# Altium schematic sheet CPU_51.SchDoc: LiveDesign Evaluation - Countdown
size A4; Organization: Altium Limited; Address1: L3, 12a Rodborough Rd; Address2: Frenchs Forest; Address3: NSW; Address4: Australia 2086; DocumentNumber: 2; SheetNumber: 2; SheetTotal: 11
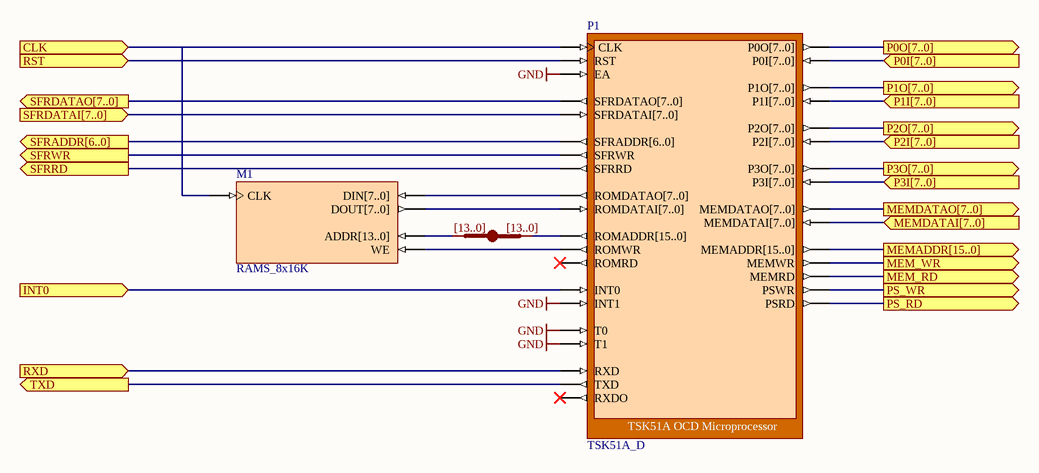
[diagram p0: CPU_51.SchDoc]

## Parts
JB_S1  IndexA: [13..0]  (hidden comment: JB)
M1  RAMS_8x16K
P1  TSK51A_D

## Ports
CLK (in), INT0 (in), MEM_RD (out), MEM_WR (out), MEMADDR[15..0] (out), MEMDATAI[7..0] (in), MEMDATAO[7..0] (out), P0I[7..0] (in), P0O[7..0] (out), P1I[7..0] (in), P1O[7..0] (out), P2I[7..0] (in), P2O[7..0] (out), P3I[7..0] (in), P3O[7..0] (out), PS_RD (out), PS_WR (out), RST (in), RXD (in), SFRADDR[6..0] (out), SFRDATAI[7..0] (in), SFRDATAO[7..0] (out), SFRRD (out), SFRWR (out), TXD (out)

## Nets
GND: P1.EA P1.INT1 P1.T0 P1.T1
CLK: M1.CLK P1.CLK ; port CLK
INT0: P1.INT0 ; port INT0
MEM_RD: P1.MEMRD ; port MEM_RD
MEM_WR: P1.MEMWR ; port MEM_WR
MEMADDR[15..0]: P1.MEMADDR[15..0] ; port MEMADDR[15..0]
MEMDATAI[7..0]: P1.MEMDATAI[7..0] ; port MEMDATAI[7..0]
MEMDATAO[7..0]: P1.MEMDATAO[7..0] ; port MEMDATAO[7..0]
P0I[7..0]: P1.P0I[7..0] ; port P0I[7..0]
P0O[7..0]: P1.P0O[7..0] ; port P0O[7..0]
P1I[7..0]: P1.P1I[7..0] ; port P1I[7..0]
P1O[7..0]: P1.P1O[7..0] ; port P1O[7..0]
P2I[7..0]: P1.P2I[7..0] ; port P2I[7..0]
P2O[7..0]: P1.P2O[7..0] ; port P2O[7..0]
P3I[7..0]: P1.P3I[7..0] ; port P3I[7..0]
P3O[7..0]: P1.P3O[7..0] ; port P3O[7..0]
PS_RD: P1.PSRD ; port PS_RD
PS_WR: P1.PSWR ; port PS_WR
RST: P1.RST ; port RST
RXD: P1.RXD ; port RXD
SFRADDR[6..0]: P1.SFRADDR[6..0] ; port SFRADDR[6..0]
SFRDATAI[7..0]: P1.SFRDATAI[7..0] ; port SFRDATAI[7..0]
SFRDATAO[7..0]: P1.SFRDATAO[7..0] ; port SFRDATAO[7..0]
SFRRD: P1.SFRRD ; port SFRRD
SFRWR: P1.SFRWR ; port SFRWR
TXD: P1.TXD ; port TXD
NetJB_S1_A[0..0]: JB_S1.A[0..0] M1.ADDR[13..0]
NetJB_S1_B[0..0]: JB_S1.B[0..0] P1.ROMADDR[15..0]
NetM1_DIN[7..0]: M1.DIN[7..0] P1.ROMDATAO[7..0]
NetM1_DOUT[7..0]: M1.DOUT[7..0] P1.ROMDATAI[7..0]
NetM1_WE: M1.WE P1.ROMWR

Not connected (* = marked no-connect by the designer): P1 ROMRD* RXDO*

## Notes on the sheet
- Title
- Size:
- Date:
- A4
- Number:
- Time:
- Revision:
- Sheet
- of
- File:

## Library data of the parts
JB_S1 = JB: System BUS Joiner; Published: 29-Jan-2004; Publisher: Altium Limited; Core Revision: 1.00.00; HelpURL: CR0118 FPGA Generic Library Guide.pdf#page=296; Functional Class: Bus Joiner; IndexB: [13..0]
M1 = RAMS_8x16K: Single Port RAM; Memory_Depth: 16384; Memory_Type: RAM_SinglePortBlock; Memory_Width: 8; Memory_ClockEdge: Rising; Nexus_Core: Memory_Program; Memory_EnablePin: False; Published: 23/04/2004; Publisher: Altium Hobart Technology Center
P1 = TSK51A_D: TSK51A OCD Microprocessor; NEXUS_CORE: Processor_OCDS; NEXUS_JTAG_DEVICE: True; NEXUS_JTAG_ORDER: 0; ChildModel1: RAM256x8_TSK51D; ChildCore1: M1; Memory_Configuration: Record[NEXUS_CORE]{}ComponentDesignator[iram]{}Memory_Depth[256]{}Memory_UsageType[ram]{}ProgramDownloadAddress[0x0]{}Memory_BusType[c51:idata_bus]{n}Record[NEXUS_CORE]{}ComponentDesignator[xram]{}Memory_Depth[64k]{}Memory_UsageType[ram]{}ProgramDownloadAddress[0x0]{}Memory_BusType[c51:xdata_bus]{n}Record[NEXUS_CORE]{}ComponentDesignator[xrom]{}Memory_Depth[64k]{}Memory_UsageType[rom]{}ProgramDownloadAddress[0x0]{}Memory_BusType[c51:code_bus]{n}; Published: 10/11/2003; Publisher: Altium Hobart Technology Centre; Core Revision: 1.00.00